# EAGLE design yamaHACK (EAGLE 9.2.2)
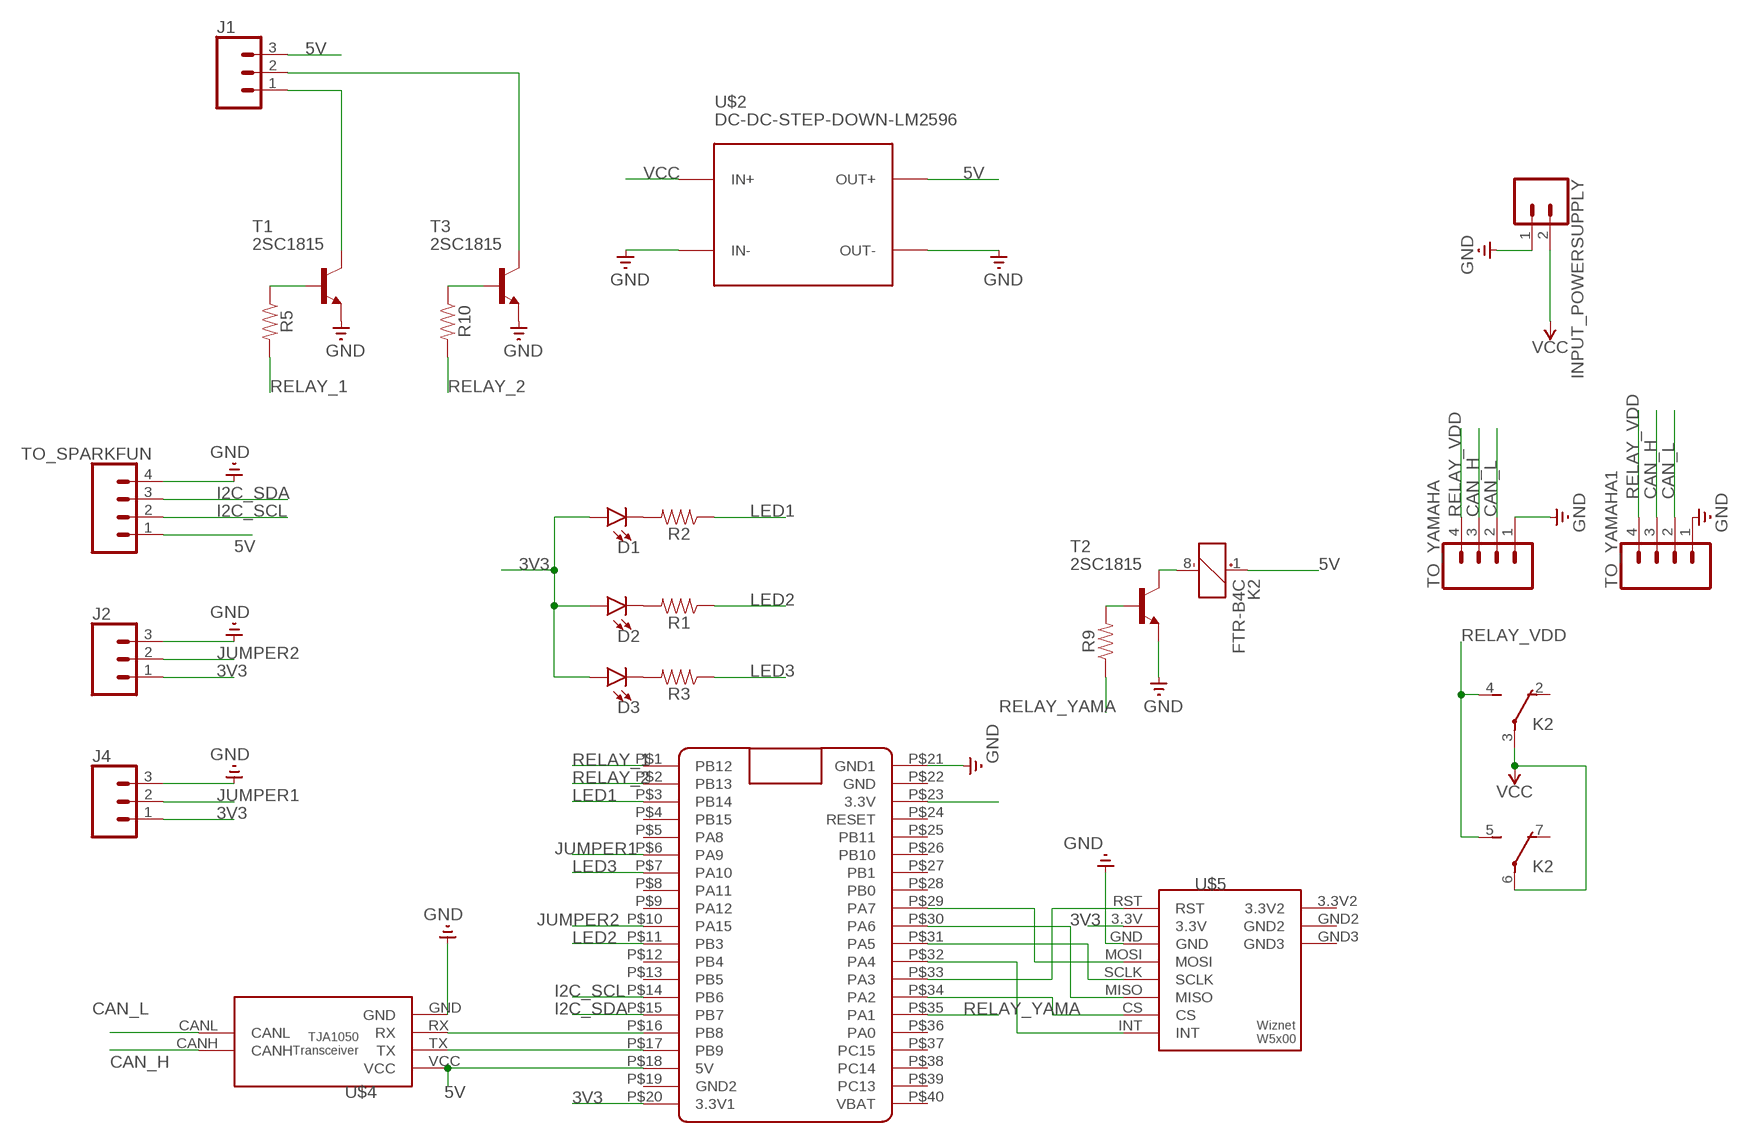
[diagram p0: schematic, sheet 1]

## Parts
D1  LED3MM  [LED_3MM]
D2  LED3MM  [LED_3MM]
D3  LED3MM  [LED_3MM]
INPUT_POWERSUPPLY  CONN_02PTH3  [1X02_LONGPADS]
J1  CONN_03  [1X03]
J2  CONN_03  [1X03]
J4  CONN_03  [1X03]
K2  FTR-B4C  [FTR-B4C]
R1  RESISTORAXIAL-0.3  [AXIAL-0.3]
R2  RESISTORAXIAL-0.3  [AXIAL-0.3]
R3  RESISTORAXIAL-0.3  [AXIAL-0.3]
R5  RESISTORAXIAL-0.3  [AXIAL-0.3]
R9  RESISTORAXIAL-0.3  [AXIAL-0.3]
R10  RESISTORAXIAL-0.3  [AXIAL-0.3]
T1  2SC1815  [TO92-ECB]
T2  2SC1815  [TO92-ECB]
T3  2SC1815  [TO92-ECB]
TO_SPARKFUN  CONN_04  [1X04]
TO_YAMAHA  CONN_04  [1X04]
TO_YAMAHA1  CONN_04  [1X04]
U$2  DC-DC-STEP-DOWN-LM2596  [DC-DC-STEP-DOWN-LM2596]
U$3  BLUE_PILL  [BLUE_PILL]
U$4  TJA1050TJA1050_WH  [TJA1050_WH]
U$5  WIZNET  [WIZNET_LITE]

## Nets
3V3: D1.A D2.A D3.A J2.1 J4.1 U$3.P$20(3.3V1) U$3.P$23(3.3V) U$5.3.3V
5V: J1.3 K2.1(K:+) TO_SPARKFUN.1 U$2.OUT+ U$3.P$18(5V) U$4.VCC
CAN_H: TO_YAMAHA1.3 TO_YAMAHA.3 U$4.CANH
CAN_L: TO_YAMAHA1.2 TO_YAMAHA.2 U$4.CANL
GND: INPUT_POWERSUPPLY.1 J2.3 J4.3 T1.E T2.E T3.E TO_SPARKFUN.4 TO_YAMAHA1.1 TO_YAMAHA.1 U$2.IN- U$2.OUT- U$3.P$21(GND1) U$4.GND U$5.GND
I2C_SCL: TO_SPARKFUN.2 U$3.P$14(PB6)
I2C_SDA: TO_SPARKFUN.3 U$3.P$15(PB7)
JUMPER1: J4.2 U$3.P$6(PA9)
JUMPER2: J2.2 U$3.P$10(PA15)
LED1: R2.P$1 U$3.P$3(PB14)
LED2: R1.P$1 U$3.P$11(PB3)
LED3: R3.P$1 U$3.P$7(PA10)
N$1: U$3.P$34(PA2) U$5.CS
N$2: U$3.P$16(PB8) U$4.RX
N$3: U$3.P$33(PA3) U$5.RST
N$4: U$3.P$32(PA4) U$5.INT
N$5: K2.8(K:-) T2.C
N$6: U$3.P$31(PA5) U$5.SCLK
N$7: R9.P$2 T2.B
N$8: U$3.P$17(PB9) U$4.TX
N$9: U$3.P$30(PA6) U$5.MISO
N$10: U$3.P$29(PA7) U$5.MOSI
N$11: D2.K(C) R1.P$2
N$12: R5.P$1 T1.B
N$13: D1.K(C) R2.P$2
N$14: J1.1 T1.C
N$15: R10.P$1 T3.B
N$16: J1.2 T3.C
N$17: D3.K(C) R3.P$2
RELAY_1: R5.P$2 U$3.P$1(PB12)
RELAY_2: R10.P$2 U$3.P$2(PB13)
RELAY_VDD: K2.4(-1:S) K2.5(-2:S) TO_YAMAHA1.4 TO_YAMAHA.4
RELAY_YAMA: R9.P$1 U$3.P$35(PA1)
VCC: INPUT_POWERSUPPLY.2 K2.3(-1:P) K2.6(-2:P) U$2.IN+
Unconnected: K2.2(-1:O) K2.7(-2:O) U$3.P$4(PB15) U$3.P$5(PA8) U$3.P$8(PA11) U$3.P$9(PA12) U$3.P$12(PB4) U$3.P$13(PB5) U$3.P$19(GND2) U$3.P$22(GND) U$3.P$24(RESET) U$3.P$25(PB11) U$3.P$26(PB10) U$3.P$27(PB1) U$3.P$28(PB0) U$3.P$36(PA0) U$3.P$37(PC15) U$3.P$38(PC14) U$3.P$39(PC13) U$3.P$40(VBAT) U$5.3.3V2 U$5.GND2 U$5.GND3

## Library data of the parts
D1-D3 = SparkFun-LED:LED: LED (Generic) Standard schematic elements and footprints for 5mm, 3mm, 1206, and 0603 sized LEDs. Generic LEDs with no color specified.; PROD_ID: DIO-08794
INPUT_POWERSUPPLY = SparkFun-Connectors:CONN_02: Multi connection point. Often used as Generic Header-pin footprint for 0.1 inch spaced/style header connections On any of the 0.1 inch spaced packages, you can populate with these: Break Away Headers - Straight <https://www.sparkfun.com/products/116> (PRT-00116) Break Away Male Headers - Right Angle <https://www.sparkfun.com/products/553> (PRT-00553) Female Headers <https://www.sparkfun.com/products/115> (PRT-00115) Break Away Headers - Machine Pin <https://www.sparkfun.com/products/117> (PRT-00117) Break Away Female Headers - Swiss Machine Pin <https://www.sparkfun.com/products/743> (PRT-00743) For SCREWTERMINALS and SPRING TERMINALS visit here: Screw Terimnals on SparkFun.com <https://www.sparkfun.com/search/results?term=Screw+Terminals> (5mm/3.5mm/2.54mm spacing) This device is also useful as a general connection point to wire up your design to another part of your project. Our various solder wires solder well into these plated through hole pads. Hook-Up Wire - Assortment (Stranded, 22 AWG) <https://www.sparkfun.com/products/11375> (PRT-11375) Hook-Up Wire - Assortment (Solid Core, 22 AWG) <https://www.sparkfun.com/products/11367> (PRT-11367) View the entire wire category on our website here <https://www.sparkfun.com/categories/141> Special notes: Molex polarized connector foot print use with: PRT-08233 with associated crimp pins and housings. 2.54_SCREWTERM for use with PRT-10571. 3.5mm Screw Terminal footprints for PRT-08084 5mm Screw Terminal footprints for use with PRT-08432
J1 J2 J4 = SparkFun-Connectors:CONN_03: Multi connection point. Often used as Generic Header-pin footprint for 0.1 inch spaced/style header connections On any of the 0.1 inch spaced packages, you can populate with these: Break Away Headers - Straight <https://www.sparkfun.com/products/116> (PRT-00116) Break Away Male Headers - Right Angle <https://www.sparkfun.com/products/553> (PRT-00553) Female Headers <https://www.sparkfun.com/products/115> (PRT-00115) Break Away Headers - Machine Pin <https://www.sparkfun.com/products/117> (PRT-00117) Break Away Female Headers - Swiss Machine Pin <https://www.sparkfun.com/products/743> (PRT-00743) Stackable Header - 3 Pin (Female, 0.1") <https://www.sparkfun.com/products/13875> (PRT-13875) For SCREWTERMINALS and SPRING TERMINALS visit here: Screw Terimnals on SparkFun.com <https://www.sparkfun.com/search/results?term=Screw+Terminals> (5mm/3.5mm/2.54mm spacing) This device is also useful as a general connection point to wire up your design to another part of your project. Our various solder wires solder well into these plated through hole pads. Hook-Up Wire - Assortment (Stranded, 22 AWG) <https://www.sparkfun.com/products/11375> (PRT-11375) Hook-Up Wire - Assortment (Solid Core, 22 AWG) <https://www.sparkfun.com/products/11367> (PRT-11367) View the entire wire category on our website here <https://www.sparkfun.com/categories/141> Special notes: Molex polarized connector foot print use with SKU : PRT-08232 with associated crimp pins and housings.
K2 = relay:FTR-B4: ULTRA MINIATURE RELAY 2 POLES - 2 A (Slim Profile Signal Relay) FUJITSU FTR-B4 SERIES Source: FTR-B4.pdf
R1-R3 R5 R9 R10 = SparkFun-Resistors:RESISTOR: Generic Resistor Package
T1-T3 = transistor:2SC1815: NPN EPITAXIAL TRANSISTOR Source: TOSHIBA .. 2SC1815 1.pdf
TO_SPARKFUN TO_YAMAHA TO_YAMAHA1 = SparkFun-Connectors:CONN_04: Multi connection point. Often used as Generic Header-pin footprint for 0.1 inch spaced/style header connections On any of the 0.1 inch spaced packages, you can populate with these: Break Away Headers - Straight <https://www.sparkfun.com/products/116> (PRT-00116) Break Away Male Headers - Right Angle <https://www.sparkfun.com/products/553> (PRT-00553) Female Headers <https://www.sparkfun.com/products/115> (PRT-00115) Break Away Headers - Machine Pin <https://www.sparkfun.com/products/117> (PRT-00117) Break Away Female Headers - Swiss Machine Pin <https://www.sparkfun.com/products/743> (PRT-00743) For SCREWTERMINALS and SPRING TERMINALS visit here: Screw Terimnals on SparkFun.com <https://www.sparkfun.com/search/results?term=Screw+Terminals> (5mm/3.5mm/2.54mm spacing) This device is also useful as a general connection point to wire up your design to another part of your project. Our various solder wires solder well into these plated through hole pads. Hook-Up Wire - Assortment (Stranded, 22 AWG) <https://www.sparkfun.com/products/11375> (PRT-11375) Hook-Up Wire - Assortment (Solid Core, 22 AWG) <https://www.sparkfun.com/products/11367> (PRT-11367) View the entire wire category on our website here <https://www.sparkfun.com/categories/141> Special notes: Molex polarized connector foot print use with SKU : PRT-08231 with associated crimp pins and housings. 1MM SMD Version SKU: PRT-10208; PROD_ID: CONN-09696
U$2 = diy-modules:DC-DC-STEP-DOWN-LM2596: DC/DC Step-Down Regulator based on LM2596-ADJ chip LM2596 datasheet available here: http://www.ti.com/lit/ds/symlink/lm2596.pdf Click here to find device on ebay.com <http://www.ebay.com/sch/lm2596+power+regulator>
U$3 = BluePill:BLUE_PILL
U$4 = LEME_Eagle_Library:TJA1050
U$5 = LEME_Eagle_Library:WIZNET

## Board
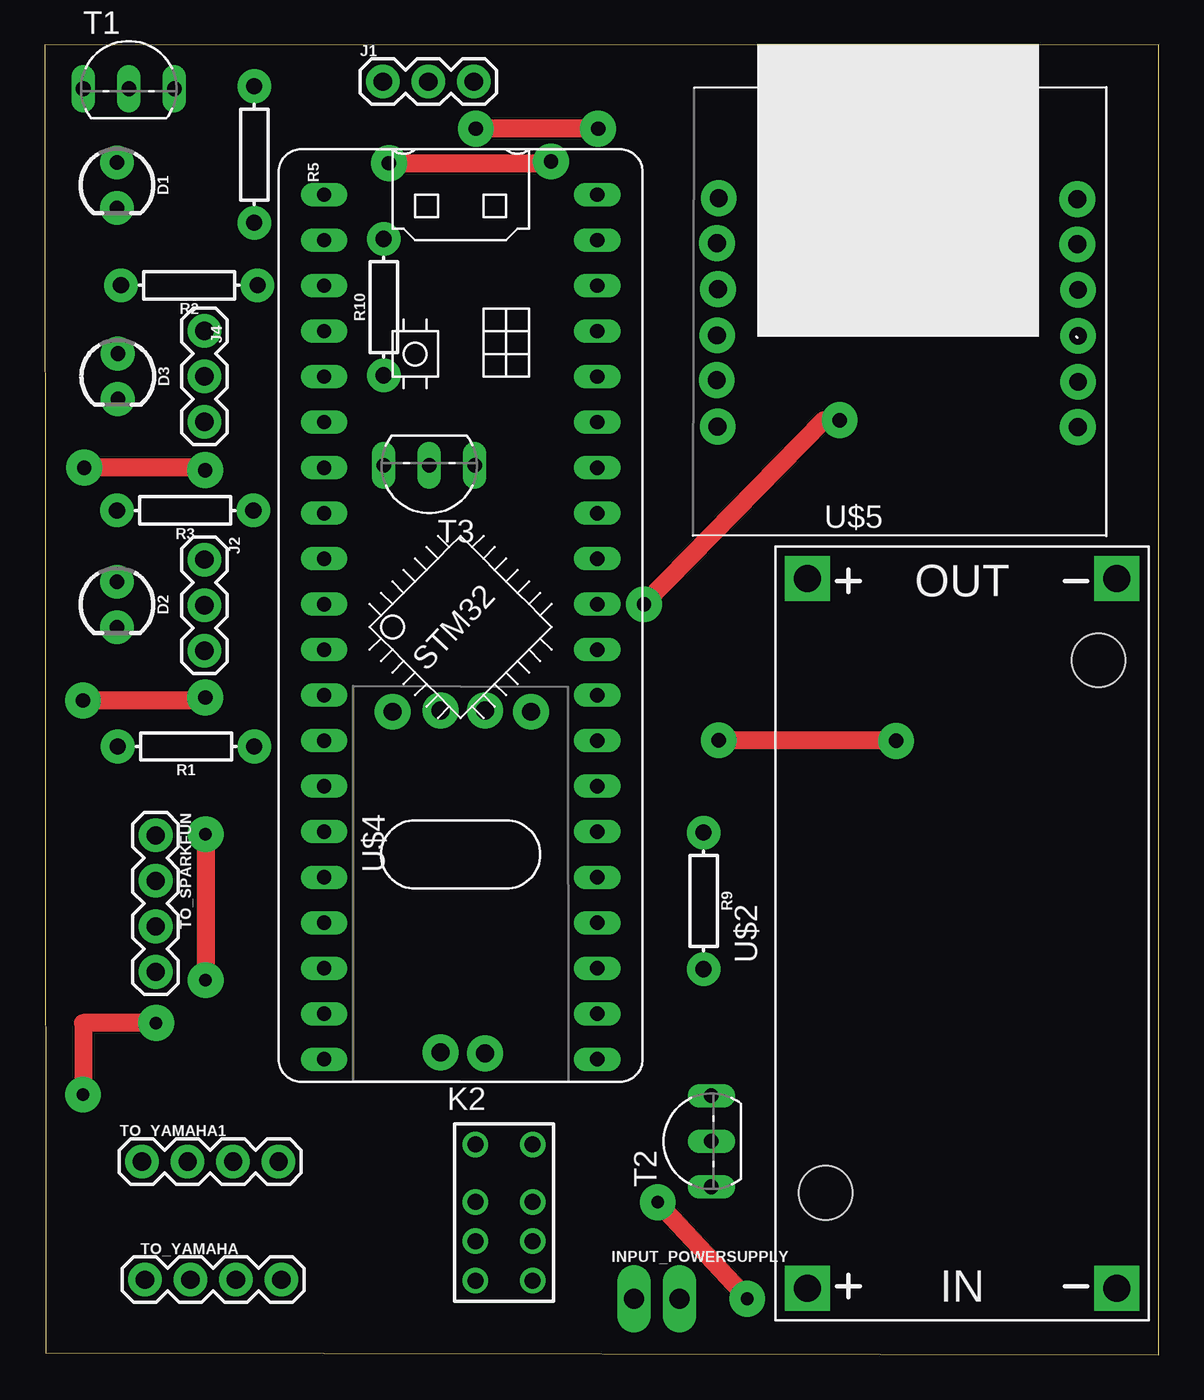
[diagram p1: board, top side]
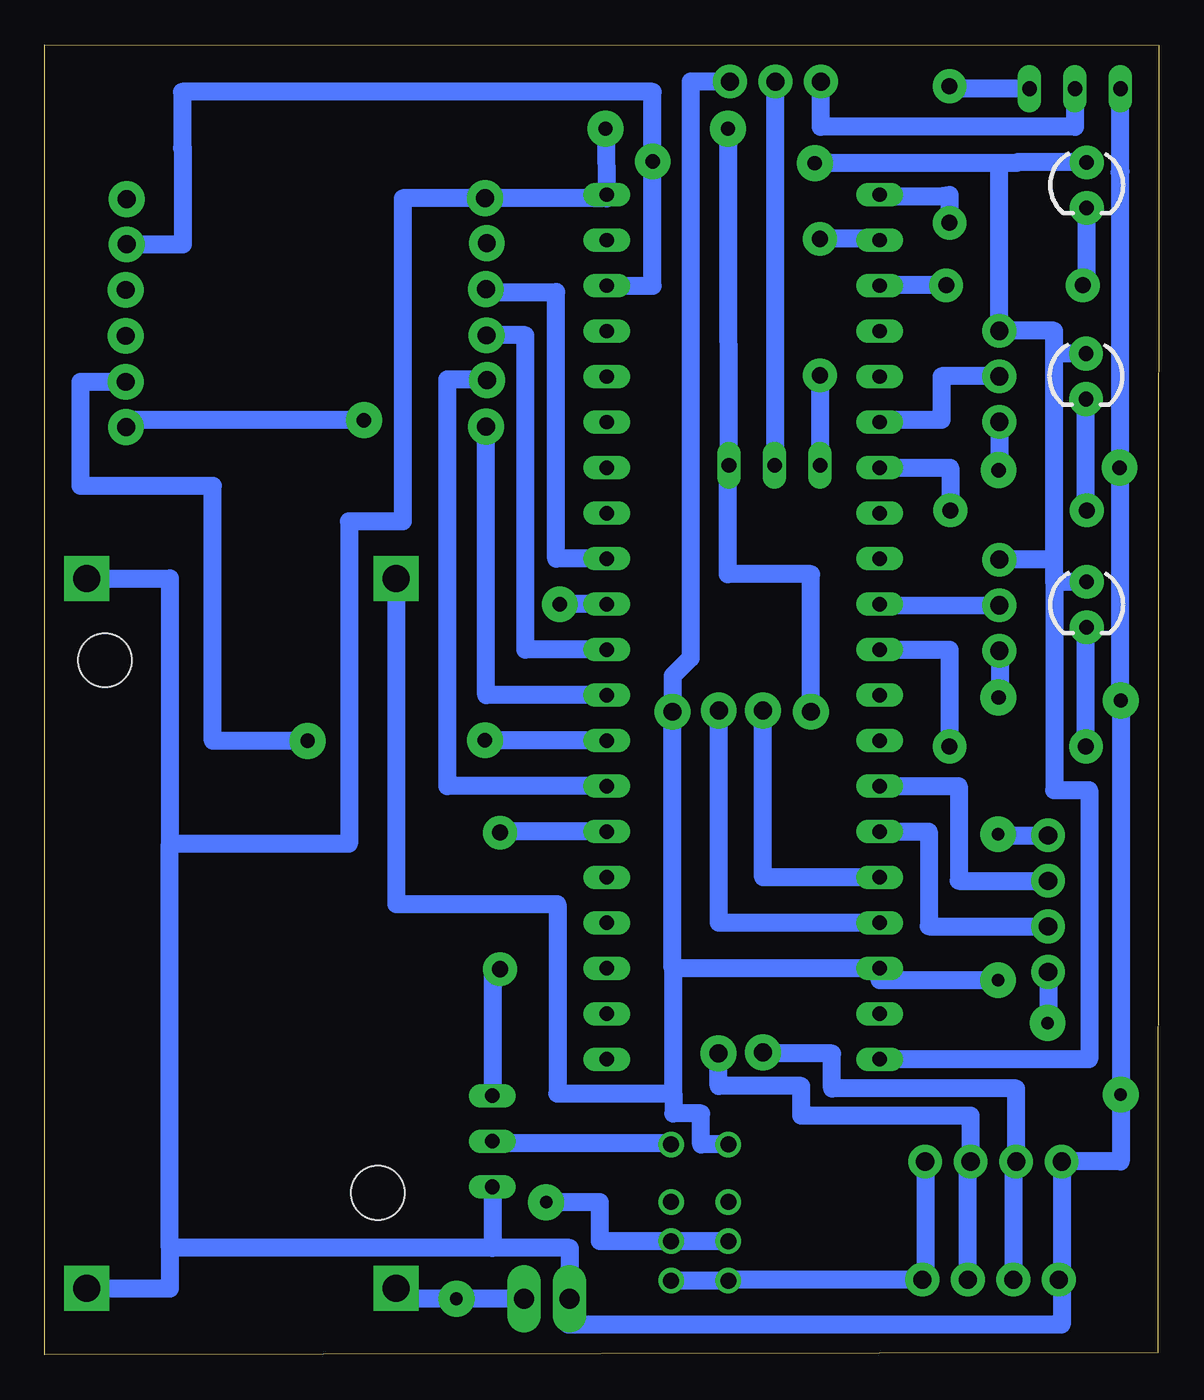
[diagram p2: board, bottom side, seen from below]

Size 62.2 x 73.12 mm. Coordinates in mm from the lower left corner, seen from the top.
Outline: 0.06,0.12 62.2,0 62.2,73.12 0,73.09 0.06,0.12
Copper layers (1*16): Top 0.035mm / dielectric 1.5mm / Bottom 0.035mm
Design rules "default *": minimum track width 6mil, minimum drill 0.35mm, track to track 0.2mm, track to pad 0.2mm, pad to pad 0.2mm, via to via 0.2mm, smd to smd 0.2mm, copper to edge 40mil, drill to drill 6mil, minimum pad ring 10mil, minimum via ring 8mil, stop-mask expansion 4mil, vias tented up to drill 0mil, thermal gap 10mil

### Footprints (pad centres in the part's own frame; a part is rotated, then mirrored left to right if it is on the bottom)
LED_3MM = drill 0.813 pad 1.88: A -1.27,0; K 1.27,0
1X02_LONGPADS = drill 1.118 pad 1.88 long: 1 0,0; 2 2.54,0
1X03 = drill 1.016 pad 1.88: 1 0,0; 2 2.54,0; 3 5.08,0
FTR-B4C = drill 0.9 pad 1.422: 1 -3.8,-1.6; 2 -0.6,-1.6; 3 1.6,-1.6; 4 3.8,-1.6; 5 3.8,1.6; 6 1.6,1.6; 7 -0.6,1.6; 8 -3.8,1.6
AXIAL-0.3 = drill 0.9 pad 1.88: P$1 -3.81,0; P$2 3.81,0
TO92-ECB = drill 0.813 long: B 2.54,0; C 0,0; E -2.54,0
1X04 = drill 1.016 pad 1.88: 1 0,0; 2 2.54,0; 3 5.08,0; 4 7.62,0
DC-DC-STEP-DOWN-LM2596 = drill 1.5 pad 2.5 square: IN+ -19.812,8.636; IN- -19.812,-8.636; OUT+ 19.812,8.636; OUT- 19.812,-8.636 | hole 3: -14.478,7.62; 15.24,-7.62
BLUE_PILL = drill 0.8 long: P$1 -7.62,15.24; P$2 -7.62,12.7; P$3 -7.62,10.16; P$4 -7.62,7.62; P$5 -7.62,5.08; P$6 -7.62,2.54; P$7 -7.62,0; P$8 -7.62,-2.54; P$9 -7.62,-5.08; P$10 -7.62,-7.62; P$11 -7.62,-10.16; P$12 -7.62,-12.7; P$13 -7.62,-15.24; P$14 -7.62,-17.78; P$15 -7.62,-20.32; P$16 -7.62,-22.86; P$17 -7.62,-25.4; P$18 -7.62,-27.94; P$19 -7.62,-30.48; P$20 -7.62,-33.02; P$21 7.62,15.24; P$22 7.62,12.7; P$23 7.62,10.16; P$24 7.62,7.62; P$25 7.62,5.08; P$26 7.62,2.54; P$27 7.62,0; P$28 7.62,-2.54; P$29 7.62,-5.08; P$30 7.62,-7.62; P$31 7.62,-10.16; P$32 7.62,-12.7; P$33 7.62,-15.24; P$34 7.62,-17.78; P$35 7.62,-20.32; P$36 7.62,-22.86; P$37 7.62,-25.4; P$38 7.62,-27.94; P$39 7.62,-30.48; P$40 7.62,-33.02
TJA1050_WH = drill 1 pad 2: CANH 9.144,0.912; CANL 9.096,-1.57; GND -9.916,-4.247; RX -9.984,-1.57; TX -9.984,0.902; VCC -9.916,3.477
WIZNET_LITE = drill 1 pad 2: 3.3V 9.885,9.892; 3.3V2 9.935,7.352; CS -10.236,2.315; GND -10.125,12.469; GND2 -10.225,9.96; GND3 9.885,12.424; INT -10.186,-0.285; MISO 9.915,-0.317; MOSI -10.175,7.392; NC 9.935,4.783; RST 9.935,2.215; SCLK -10.215,4.812

### Placement (x,y rotation side)
D1  4.03,65.29 270 top
D2  4.03,41.87 270 top
D3  4.07,54.61 270 top
INPUT_POWERSUPPLY  32.9,3.12 0 top
J1  18.87,71.07 0 top
J2  8.91,44.38 270 top
J4  8.91,57.16 270 top
K2  25.64,7.93 270 top
R1  7.88,33.95 180 top
R2  8.06,59.7 180 top
R3  7.84,47.13 180 top
R5  11.69,67 270 top
R9  36.78,25.34 270 top
R10  18.92,58.48 90 top
T1  4.69,70.67 0 top
T2  37.21,11.91 90 top
T3  21.46,49.64 180 top
TO_SPARKFUN  6.19,28.99 270 top
TO_YAMAHA  5.59,4.19 0 top
TO_YAMAHA1  5.43,10.79 0 top
U$2  51.21,23.52 90 top
U$3  23.21,49.52 0 top
U$4  23.67,25.97 270 top
U$5  47.75,52.09 0 top

### Tracks (layer width: path | path; a pad name or v marks a point on that pad's centre or on a via)
3V3  (via drill 0.8 pad 2)
  Top 1: v28.26,66.61 28.21,66.52 v19.21,66.52
  Bottom 1: U$5.3.3V 57.63,61.97 54.5,61.97 54.5,67.35 54.53,67.35 54.53,70.5 28.26,70.5 v28.26,66.61 28.26,59.68 U$3.P$23 | 5.85,44.38 J2.1 | 5.85,43.14 5.85,44.38 | 5.85,44.38 5.85,55.88 | 5.85,55.88 5.85,57.16 J4.1 8.91,66.52 | 8.91,66.52 7.95,66.52 7.95,66.56 D1.A | 8.91,66.52 v19.21,66.52 | D3.A 5.85,55.88 | D2.A 5.85,43.14 | 5.85,43.14 5.85,31.52 3.9,31.52 3.9,16.5 U$3.P$20
5V  (via drill 0.7 pad 2)
  Top 1: v8.98,29.06 v8.98,20.91
  Bottom 1: 27.1,21.58 U$3.P$18 15.59,20.91 v8.98,20.91 | 42.67,43.33 U$2.OUT+ 42.58,25.15 33.59,25.15 33.59,14.58 27.1,14.58 | J1.3 26.15,71.07 26.15,38.89 27.15,37.89 U$4.VCC 27.15,21.58 27.1,21.58 | 27.1,14.58 27.1,13.46 25.56,13.46 25.56,11.73 K2.1 | v8.98,29.06 8.91,28.99 TO_SPARKFUN.1 | 27.1,14.58 27.1,21.58
CAN_H
  Bottom 1: U$4.CANH 24.58,15 19.96,15 19.96,13.34 10.51,13.34 TO_YAMAHA1.3 10.67,10.79 TO_YAMAHA.3
CAN_L
  Bottom 1: TO_YAMAHA.2 8.13,10.63 TO_YAMAHA1.2 7.97,14.86 18.24,14.86 18.24,16.81 22.1,16.81 U$4.CANL 22.21,16.88
GND  (via drill 0.7 pad 2, 0.8 pad 2)
  Top 1: v30.89,68.44 v24.07,68.44 v24.06,68.44 | 8.96,36.52 v8.96,36.68 8.96,36.52 v2.13,36.52 | v8.95,49.38 8.95,49.52 v2.2,49.52 | v6.21,18.52 2.13,18.52 v2.13,14.52
  Bottom 1: 19.21,36.1 U$4.GND 19.42,43.57 24.07,43.57 24.07,49.64 T3.E 24.04,63.3 24.04,68.43 v24.06,68.44 | U$2.OUT- 55.21,43.33 55.21,28.52 | 55.21,5.96 55.21,3.7 U$2.IN- | T1.E 2.15,66.04 2.19,66 2.19,49.52 | U$3.P$21 30.83,64.56 U$5.GND 42.21,64.56 42.21,46.52 45.21,46.52 45.21,28.52 55.21,28.52 | 37.29,9.45 T2.E 37.21,5.96 | 30.83,64.78 U$3.P$21 | v30.89,68.44 | v30.89,68.44 30.83,65.76 U$3.P$21 | v8.96,36.68 8.86,36.68 8.86,36.52 J2.3 | J4.3 8.91,49.42 v8.95,49.38 | 37.21,5.96 32.9,5.96 INPUT_POWERSUPPLY.1 32.99,3.04 32.99,1.68 5.43,1.68 5.43,4.19 TO_YAMAHA.1 5.43,4.19 TO_YAMAHA1.1 2.13,10.79 v2.13,14.52 v2.13,36.52 2.19,36.52 2.19,49.52 | 37.21,5.96 55.21,5.96 | 55.21,5.96 55.21,28.52 | v2.2,49.52 2.19,49.52 | TO_SPARKFUN.4 6.19,18.52 v6.21,18.52
I2C_SCL
  Bottom 1: U$3.P$14 11.18,31.74 11.18,26.45 TO_SPARKFUN.2
I2C_SDA
  Bottom 1: U$3.P$15 12.86,29.2 12.86,23.91 TO_SPARKFUN.3
JUMPER1
  Bottom 1: J4.2 12.14,54.62 12.14,52.18 15.59,52.18 U$3.P$6
JUMPER2
  Bottom 1: U$3.P$10 15.52,41.82 J2.2
LED1
  Bottom 1: U$3.P$3 15.59,59.7 R2.P$1
LED2
  Bottom 1: U$3.P$11 11.69,39.36 R1.P$1
LED3
  Bottom 1: U$3.P$7 11.65,49.52 R3.P$1
N$1
  Bottom 1: U$3.P$34 39.72,31.74 39.72,54.45 37.51,54.45 U$5.CS
N$2
  Bottom 1: U$3.P$16 22.1,26.66 U$4.RX
N$3  (via drill 0.8 pad 2)
  Top 1: v47.52,34.27 47.49,34.3 v37.62,34.3
  Bottom 1: U$3.P$33 37.6,34.28 v37.62,34.3 | 57.68,54.23 U$5.RST 60.21,54.3 60.21,48.52 52.82,48.52 52.82,34.27 v47.52,34.27
N$4
  Bottom 1: U$3.P$32 37.56,36.82 U$5.INT
N$5
  Bottom 1: K2.8 27.32,11.82 37.21,11.82 T2.C
N$6
  Bottom 1: U$3.P$31 35.37,39.36 35.37,56.91 37.53,56.91 U$5.SCLK
N$7
  Bottom 1: R9.P$2 37.21,21.53 T2.B
N$8
  Bottom 1: U$3.P$17 24.57,24.12 U$4.TX
N$9  (via drill 0.8 pad 2)
  Top 1: v44.38,52.16 43.49,52.16 v33.45,41.89
  Bottom 1: U$3.P$30 v33.45,41.9 v33.45,41.89 | v44.38,52.16 57.66,52.16 U$5.MISO
N$10
  Bottom 1: U$3.P$29 33.66,44.44 33.66,59.32 37.42,59.32 U$5.MOSI
N$11
  Bottom 1: R1.P$2 4.07,40.6 D2.K
N$12
  Bottom 1: T1.B 11.69,70.67 R5.P$1
N$13
  Bottom 1: R2.P$2 4.03,59.7 D1.K
N$14
  Bottom 1: J1.1 18.87,68.54 4.69,68.54 T1.C
N$15
  Bottom 1: R10.P$1 T3.B
N$16
  Bottom 1: T3.C 21.41,49.64 J1.2
N$17
  Bottom 1: R3.P$2 4.07,47.13 D3.K
RELAY_1
  Bottom 1: U$3.P$1 15.51,64.67 12.07,64.67 11.69,64.74 R5.P$2
RELAY_2
  Bottom 1: U$3.P$2 15.59,62.29 R10.P$2
RELAY_VDD
  Bottom 1: K2.5 K2.4 24.04,4.19 TO_YAMAHA.4 13.05,4.35 TO_YAMAHA1.4
RELAY_YAMA
  Bottom 1: U$3.P$35 36.78,29.2 R9.P$1
VCC  (via drill 0.7 pad 2)
  Top 1: v34.21,8.52 v39.21,3.12
  Bottom 1: INPUT_POWERSUPPLY.2 v39.21,3.12 42.58,3.12 U$2.IN+ | K2.3 K2.6 31.21,6.33 31.21,8.52 v34.21,8.52